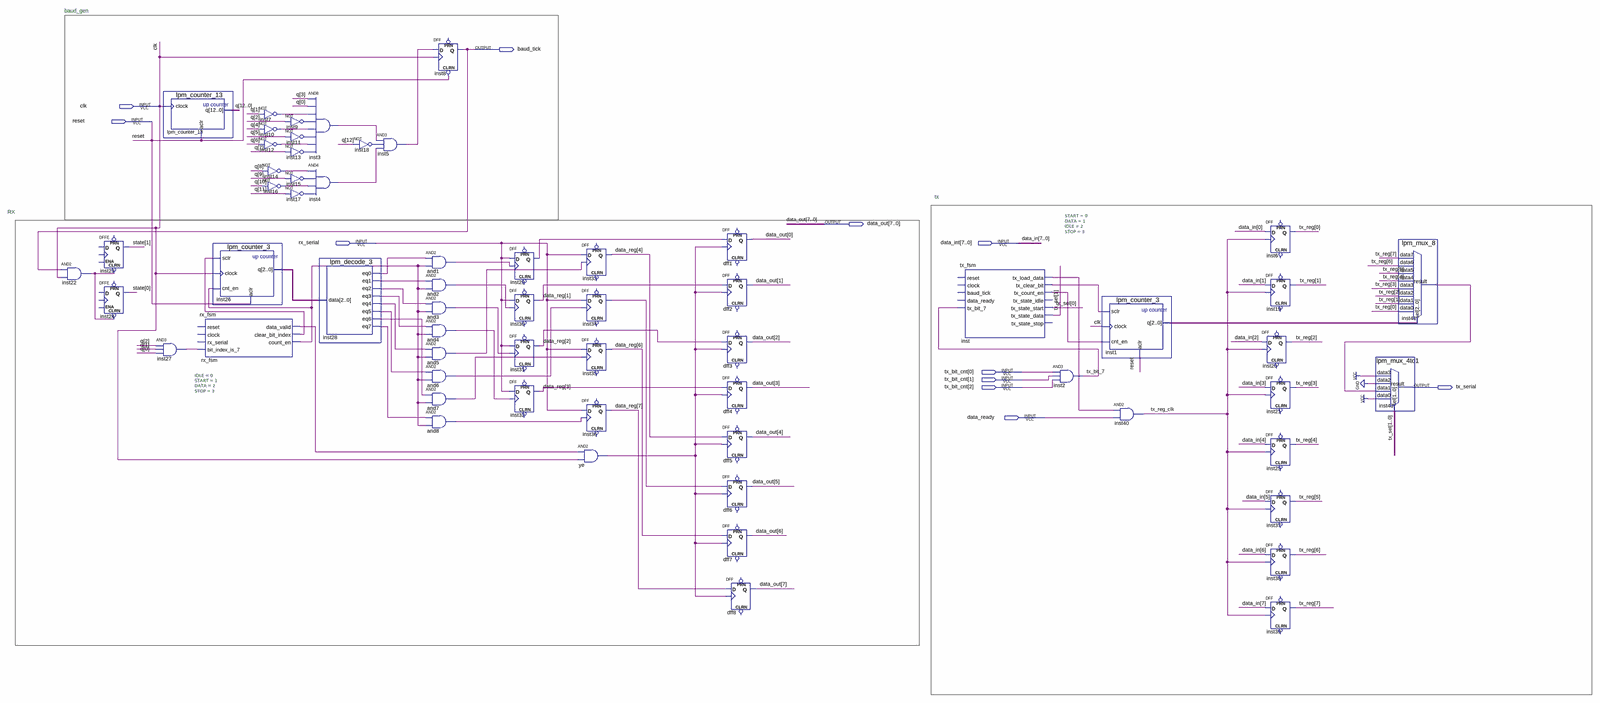
[diagram p0: schematic sheet, whole]
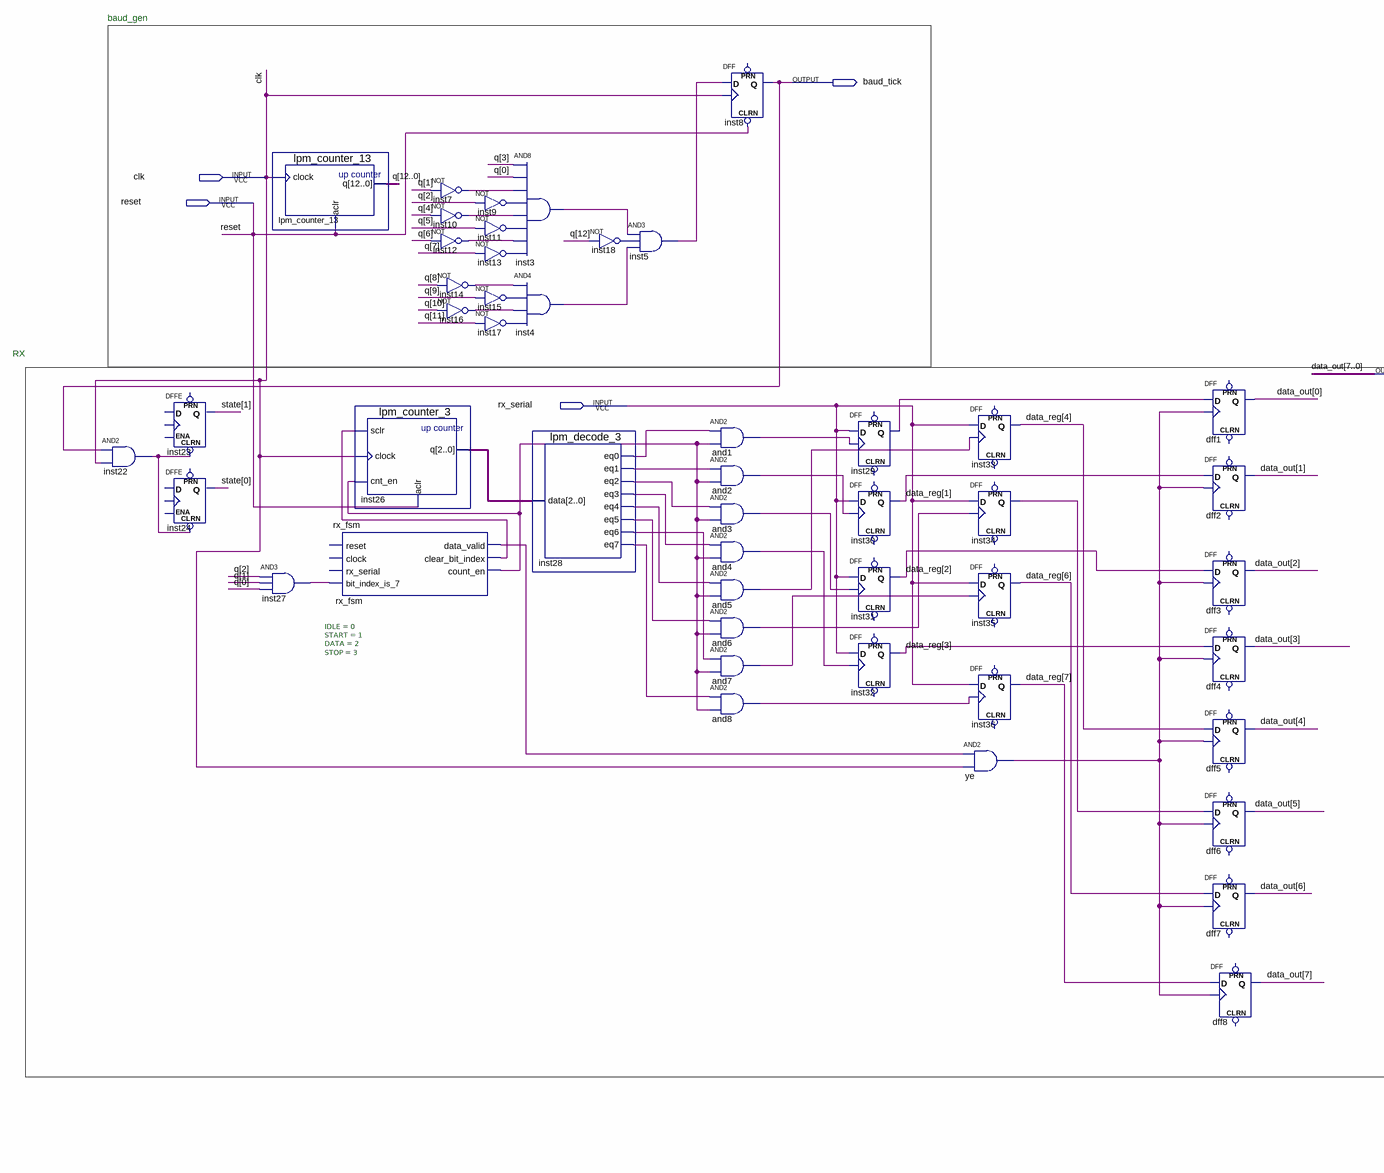
[diagram p1: schematic sheet, left part]
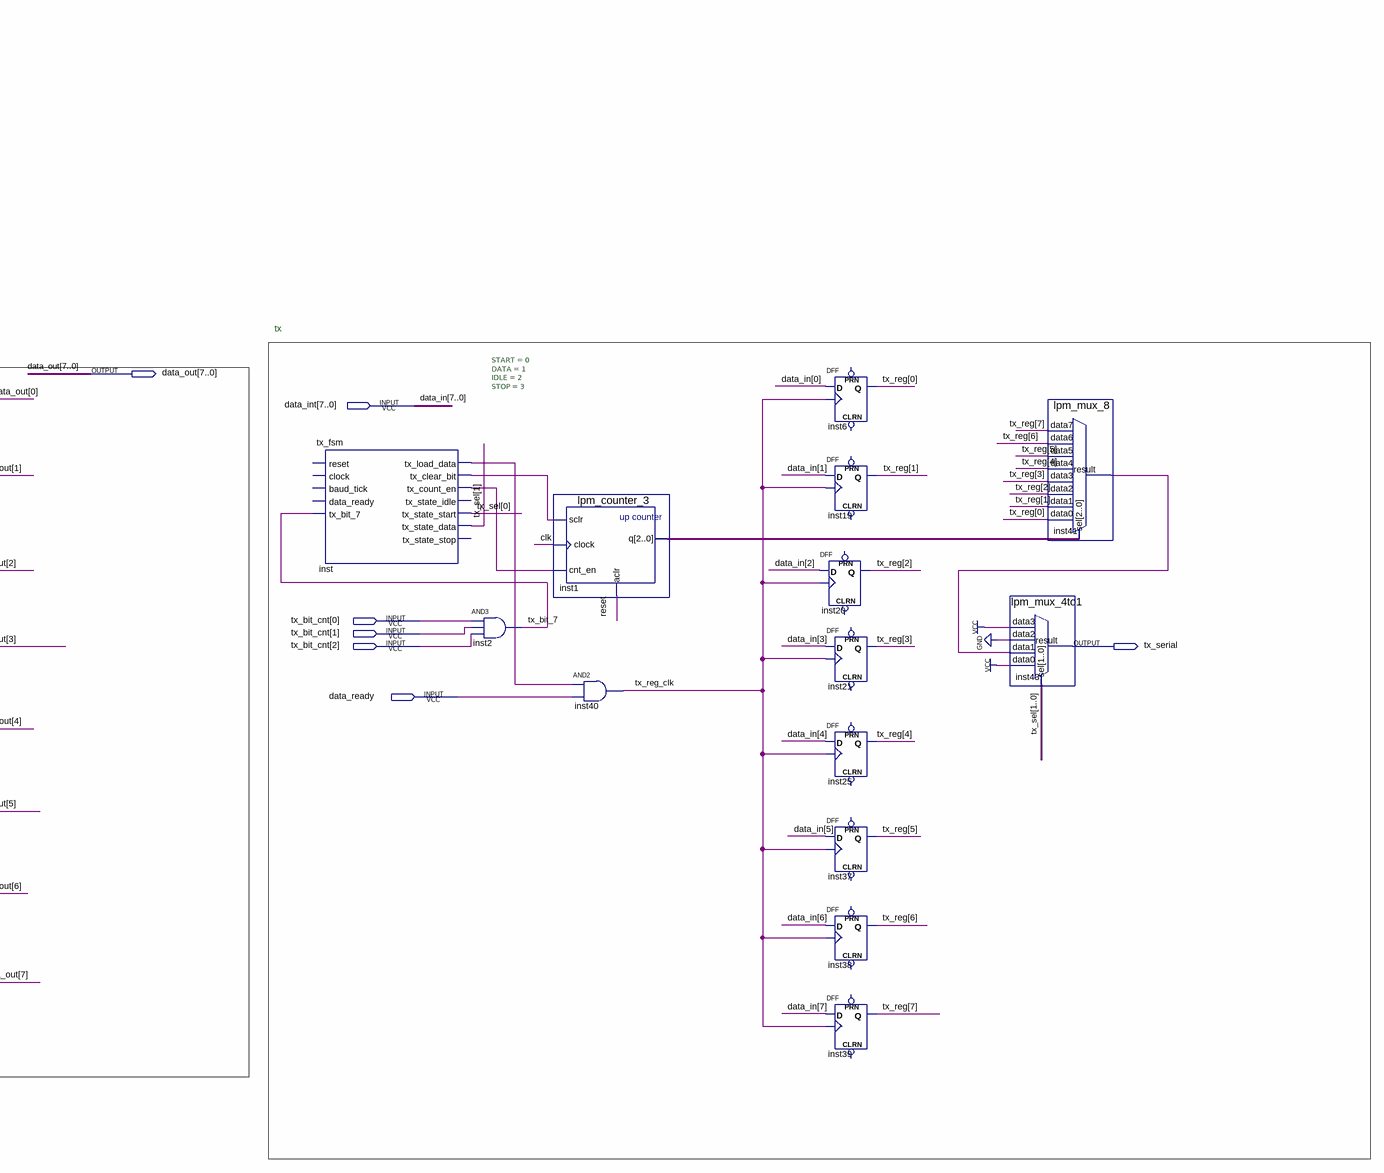
[diagram p2: schematic sheet, right part]
// Quartus schematic uart.bdf as structural Verilog: 62 symbols, 11 pins
module uart (
  input  clk,
  input  reset,
  input  rx_serial,
  input  [7:0] data_int,
  input  [2:0] tx_bit_cnt,
  input  data_ready,
  output baud_tick,
  output [7:0] data_out,
  output tx_serial
);

  wire and1_out, and2_out, and3_out, and4_out, and5_out, and6_out, and7_out, and8_out, inst3_out, inst4_out,
       inst5_out, inst7_out, inst9_out, inst10_out, inst11_out, inst12_out, inst13_out, inst14_out,
       inst15_out, inst16_out, inst17_out, inst18_out, inst22_out, inst27_out, inst28_eq0, inst28_eq1,
       inst28_eq2, inst28_eq3, inst28_eq4, inst28_eq5, inst28_eq6, inst28_eq7, inst29_q, inst34_q,
       inst41_result, inst_tx_clear_bit, inst_tx_count_en, inst_tx_load_data, rx_fsm_clear_bit_index,
       rx_fsm_count_en, rx_fsm_data_valid, tx_bit_7, tx_reg_clk, ye_out;
  wire [1:0] state, tx_sel;
  wire [2:0] inst1_q, inst26_q;
  wire [7:0] tx_reg;
  wire [7:1] data_reg;
  wire [12:0] q;

  and inst22 (inst22_out, baud_tick, clk);
  DFFE inst23 (.CLRN(inst22_out), .Q(state[1]));  // open: PRN, D, CLK, ENA
  DFFE inst24 (.CLRN(inst22_out), .Q(state[0]));  // open: PRN, D, CLK, ENA
  lpm_counter_13 lpm_counter_13 (.clock(clk), .aclr(reset), .q(q));
  and inst27 (inst27_out, q[2], q[1], q[0]);
  rx_fsm #(.IDLE(0), .START(1), .DATA(2), .STOP(3)) rx_fsm (
    .bit_index_is_7(inst27_out), .data_valid(rx_fsm_data_valid), .clear_bit_index(rx_fsm_clear_bit_index),
    .count_en(rx_fsm_count_en));  // open: reset, clock, rx_serial
  lpm_counter_3 inst26 (
    .sclr(rx_fsm_clear_bit_index), .clock(clk), .cnt_en(rx_fsm_count_en), .aclr(reset), .q(inst26_q));
  not inst7 (inst7_out, q[1]);
  not inst10 (inst10_out, q[4]);
  not inst12 (inst12_out, q[6]);
  not inst14 (inst14_out, q[8]);
  not inst16 (inst16_out, q[10]);
  not inst9 (inst9_out, q[2]);
  not inst11 (inst11_out, q[5]);
  not inst13 (inst13_out, q[7]);
  not inst15 (inst15_out, q[9]);
  not inst17 (inst17_out, q[11]);
  and inst3 (inst3_out, q[3], q[0], inst7_out, inst9_out, inst10_out, inst11_out, inst12_out, inst13_out);
  and inst4 (inst4_out, inst14_out, inst15_out, inst16_out, inst17_out);
  lpm_decode_3 inst28 (
    .data(inst26_q), .eq0(inst28_eq0), .eq1(inst28_eq1), .eq2(inst28_eq2), .eq3(inst28_eq3),
    .eq4(inst28_eq4), .eq5(inst28_eq5), .eq6(inst28_eq6), .eq7(inst28_eq7));
  not inst18 (inst18_out, q[12]);
  and inst5 (inst5_out, inst3_out, inst18_out, inst4_out);
  DFF inst8 (.CLRN(reset), .CLK(clk), .D(inst5_out), .Q(baud_tick));  // open: PRN
  and and1 (and1_out, inst28_eq0, rx_fsm_count_en);
  and and2 (and2_out, inst28_eq1, rx_fsm_count_en);
  and and3 (and3_out, inst28_eq2, rx_fsm_count_en);
  and and4 (and4_out, inst28_eq3, rx_fsm_count_en);
  and and5 (and5_out, inst28_eq4, rx_fsm_count_en);
  and and6 (and6_out, inst28_eq5, rx_fsm_count_en);
  and and7 (and7_out, inst28_eq6, rx_fsm_count_en);
  and and8 (and8_out, inst28_eq7, rx_fsm_count_en);
  DFF inst29 (.CLK(and1_out), .D(rx_serial), .Q(inst29_q));  // open: CLRN, PRN
  DFF inst30 (.CLK(and2_out), .D(rx_serial), .Q(data_reg[1]));  // open: CLRN, PRN
  DFF inst31 (.CLK(and3_out), .D(rx_serial), .Q(data_reg[2]));  // open: CLRN, PRN
  DFF inst32 (.CLK(and4_out), .D(rx_serial), .Q(data_reg[3]));  // open: CLRN, PRN
  DFF inst33 (.CLK(and5_out), .D(rx_serial), .Q(data_reg[4]));  // open: CLRN, PRN
  DFF inst34 (.CLK(and6_out), .D(rx_serial), .Q(inst34_q));  // open: CLRN, PRN
  DFF inst35 (.CLK(and7_out), .D(rx_serial), .Q(data_reg[6]));  // open: CLRN, PRN
  DFF inst36 (.CLK(and8_out), .D(rx_serial), .Q(data_reg[7]));  // open: CLRN, PRN
  and ye (ye_out, rx_fsm_data_valid, clk);
  DFF dff1 (.CLK(ye_out), .D(inst29_q), .Q(data_out[0]));  // open: CLRN, PRN
  DFF dff2 (.CLK(ye_out), .D(data_reg[1]), .Q(data_out[1]));  // open: CLRN, PRN
  DFF dff3 (.CLK(ye_out), .D(data_reg[2]), .Q(data_out[2]));  // open: CLRN, PRN
  DFF dff4 (.CLK(ye_out), .D(data_reg[3]), .Q(data_out[3]));  // open: CLRN, PRN
  DFF dff5 (.CLK(ye_out), .D(data_reg[4]), .Q(data_out[4]));  // open: CLRN, PRN
  DFF dff6 (.CLK(ye_out), .D(inst34_q), .Q(data_out[5]));  // open: CLRN, PRN
  DFF dff7 (.CLK(ye_out), .D(data_reg[6]), .Q(data_out[6]));  // open: CLRN, PRN
  DFF dff8 (.CLK(ye_out), .D(data_reg[7]), .Q(data_out[7]));  // open: CLRN, PRN
  tx_fsm #(.START(0), .DATA(1), .IDLE(2), .STOP(3)) inst (
    .tx_bit_7(tx_bit_7), .tx_load_data(inst_tx_load_data), .tx_clear_bit(inst_tx_clear_bit),
    .tx_count_en(inst_tx_count_en), .tx_state_start(tx_sel[0]), .tx_state_data(tx_sel[1]));  // open: reset, clock, baud_tick, data_ready, tx_state_idle, tx_state_stop
  and inst2 (tx_bit_7, tx_bit_cnt[0], tx_bit_cnt[1], tx_bit_cnt[2]);
  lpm_counter_3 inst1 (.sclr(inst_tx_clear_bit), .clock(clk), .cnt_en(inst_tx_count_en), .aclr(reset), .q(inst1_q));
  and inst40 (tx_reg_clk, inst_tx_load_data, data_ready);
  DFF inst6 (.CLK(tx_reg_clk), .D(data_int[0]), .Q(tx_reg[0]));  // open: CLRN, PRN
  DFF inst19 (.CLK(tx_reg_clk), .D(data_int[1]), .Q(tx_reg[1]));  // open: CLRN, PRN
  DFF inst20 (.CLK(tx_reg_clk), .D(data_int[2]), .Q(tx_reg[2]));  // open: CLRN, PRN
  DFF inst21 (.CLK(tx_reg_clk), .D(data_int[3]), .Q(tx_reg[3]));  // open: CLRN, PRN
  DFF inst25 (.CLK(tx_reg_clk), .D(data_int[4]), .Q(tx_reg[4]));  // open: CLRN, PRN
  DFF inst37 (.CLK(tx_reg_clk), .D(data_int[5]), .Q(tx_reg[5]));  // open: CLRN, PRN
  DFF inst38 (.CLK(tx_reg_clk), .D(data_int[6]), .Q(tx_reg[6]));  // open: CLRN, PRN
  DFF inst39 (.CLK(tx_reg_clk), .D(data_int[7]), .Q(tx_reg[7]));  // open: CLRN, PRN
  lpm_mux_4to1 inst43 (
    .data3(1'b1), .data2(1'b0), .data1(inst41_result), .data0(1'b1), .sel(tx_sel), .result(tx_serial));
  lpm_mux_8 inst41 (
    .data7(tx_reg[7]), .data6(tx_reg[6]), .data5(tx_reg[5]), .data4(tx_reg[4]), .data3(tx_reg[3]),
    .data2(tx_reg[2]), .data1(tx_reg[1]), .data0(tx_reg[0]), .sel(inst1_q), .result(inst41_result));

  // Other names for the same wires on the sheet: data_in[7:0] = data_int

  // Notes on the sheet:
  //   baud_gen
  //   tx
  //   RX
endmodule
